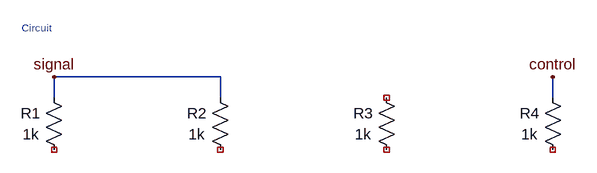
[diagram p0: schematic circuit.asc]
circuit.asc, the LTspice schematic file:
Version 4
SHEET 1 992 272
SYMBOL res 64 128 R0
WINDOW 0 -20 40 Center 2
WINDOW 3 -20 72 Center 2
SYMATTR InstName R1
SYMATTR Value 1k
SYMBOL res 320 128 R0
WINDOW 0 -20 40 Center 2
WINDOW 3 -20 72 Center 2
SYMATTR InstName R2
SYMATTR Value 1k
SYMBOL res 576 128 R0
WINDOW 0 -20 40 Center 2
WINDOW 3 -20 72 Center 2
SYMATTR InstName R3
SYMATTR Value 1k
SYMBOL res 832 128 R0
WINDOW 0 -20 40 Center 2
WINDOW 3 -20 72 Center 2
SYMATTR InstName R4
SYMATTR Value 1k
WIRE 80 112 80 144
WIRE 80 112 336 112
WIRE 336 112 336 144
WIRE 848 112 848 144
FLAG 848 112 control
FLAG 80 112 signal
TEXT 30 36 Left 1 ;Circuit

The netlist it stands for:
* circuit.asc
R1 signal NC_01 1k
R2 signal NC_02 1k
R3 NC_03 NC_04 1k
R4 control NC_05 1k
* Circuit
.backanno
.end